# EAGLE schematic schematic (EAGLE 9.7.0)
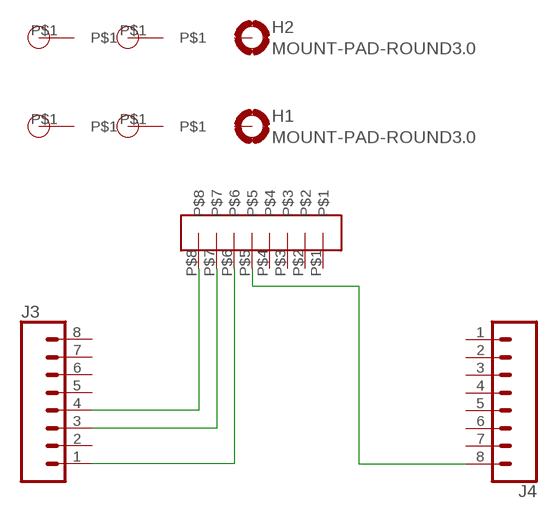
[diagram p0: schematic, sheet 1]

## Parts
H1  MOUNT-PAD-ROUND3.0  [3,0-PAD]
H2  MOUNT-PAD-ROUND3.0  [3,0-PAD]
J3  CONN_08"  [1X08]
J4  CONN_08"  [1X08]
U$1  1X08  [1X08]
U$2  MOUNT-PAD-ROUND  [2,3-PAD]
U$3  MOUNT-PAD-ROUND  [2,3-PAD]
U$4  MOUNT-PAD-ROUND  [2,3-PAD]
U$5  MOUNT-PAD-ROUND  [2,3-PAD]

## Nets
3V3: J3.1 U$1.P$6
GND: J4.8 U$1.P$5
N$3: J3.4 U$1.P$8
N$4: J3.3 U$1.P$7
Unconnected: H1.B3,0(MOUNT) H2.B3,0(MOUNT) J3.2 J3.5 J3.6 J3.7 J3.8 J4.1 J4.2 J4.3 J4.4 J4.5 J4.6 J4.7 U$1.P$1 U$1.P$2 U$1.P$3 U$1.P$4 U$2.P$1 U$3.P$1 U$4.P$1 U$5.P$1

## Library data of the parts
H1 H2 = holes:MOUNT-PAD-ROUND: MOUNTING PAD, round
J3 J4 = SparkFun-Connectors:CONN_08: Multi connection point. Often used as Generic Header-pin footprint for 0.1 inch spaced/style header connections On any of the 0.1 inch spaced packages, you can populate with these: Break Away Headers - Straight <https://www.sparkfun.com/products/116> (PRT-00116) Break Away Male Headers - Right Angle <https://www.sparkfun.com/products/553> (PRT-00553) Female Headers <https://www.sparkfun.com/products/115> (PRT-00115) Break Away Headers - Machine Pin <https://www.sparkfun.com/products/117> (PRT-00117) Break Away Female Headers - Swiss Machine Pin <https://www.sparkfun.com/products/743> (PRT-00743) Arduino Stackable Header - 8 Pin <https://www.sparkfun.com/products/9279> (PRT-09279) For SCREWTERMINALS and SPRING TERMINALS visit here: Screw Terimnals on SparkFun.com <https://www.sparkfun.com/search/results?term=Screw+Terminals> (5mm/3.5mm/2.54mm spacing) This device is also useful as a general connection point to wire up your design to another part of your project. Our various solder wires solder well into these plated through hole pads. Hook-Up Wire - Assortment (Stranded, 22 AWG) <https://www.sparkfun.com/products/11375> (PRT-11375) Hook-Up Wire - Assortment (Solid Core, 22 AWG) <https://www.sparkfun.com/products/11367> (PRT-11367) View the entire wire category on our website here <https://www.sparkfun.com/categories/141> Special notes: Molex polarized connector foot print use with SKU : PRT-08231 with associated crimp pins and housings. 1MM SMD Version SKU: PRT-10208 NOTES ON THE VARIANTS LOCK and LOCK_LONGPADS... This footprint was designed to help hold the alignment of a through-hole component (i.e. 6-pin header) while soldering it into place. You may notice that each hole has been shifted either up or down by 0.005 of an inch from it's more standard position (which is a perfectly straight line). This slight alteration caused the pins (the squares in the middle) to touch the edges of the holes. Because they are alternating, it causes a "brace" to hold the component in place. 0.005 has proven to be the perfect amount of "off-center" position when using our standard breakaway headers. Although looks a little odd when you look at the bare footprint, once you have a header in there, the alteration is very hard to notice. Also,if you push a header all the way into place, it is covered up entirely on the bottom side.; PROD_ID: CONN-08438
U$1 = pinhead_1.27mm:1X08
U$2-U$5 = holes_small:MOUNT-PAD-ROUND